# Altium schematic sheet TempSensor.SchDoc
size A4
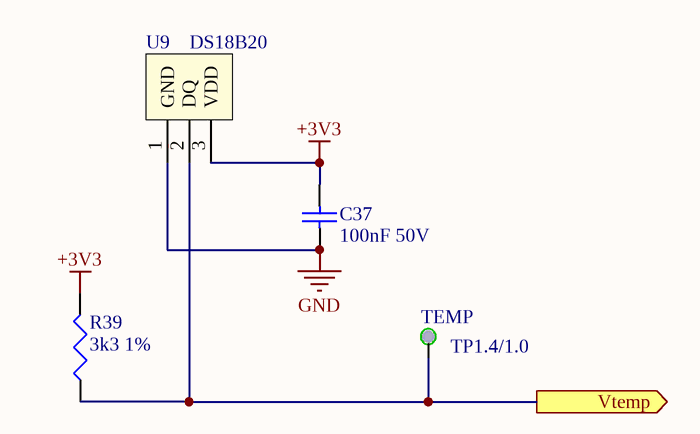
[diagram p0: TempSensor.SchDoc]

## Parts
C37  100nF 50V  [CAPC2012N]
R39  3k3 1%  [RESC2012N]
TEMP  TP1.4/1.0  [TP1.4/1.0]  (no BOM)
U9  DS18B20  [TO92 variant]

## Ports
Vtemp (out)

## Nets
+3V3: C37.2 R39.2 U9.3(VDD)
GND: C37.1 U9.1(GND)
Vtemp: R39.1 TEMP.1 U9.2(DQ) ; port Vtemp

## Library data of the parts
C37 = Cap Semi: Capacitor; Value: 100pF; Published: 8-Jun-2000; LatestRevisionDate: 29-May-2009; LatestRevisionNote: IPC-7351 Footprint Added.; PackageReference: C1206; Publisher: Altium Limited; PackageDescription: Chip Capacitor
R39 = Res3: Resistor; Value: 1K; Published: 8-Jun-2000; LatestRevisionDate: 29-May-2009; LatestRevisionNote: IPC-7351 Footprint Added.; PackageReference: J1-0603; Publisher: Altium Limited; PackageDescription: Chip Resistor
U9 = DS18B20: Digital Temperature sensor; Manufacturer: Maxim; Price: *